# Altium schematic sheet Tien.SchDoc: TKHTN project
size A4; Date: 7/11/2023; ApprovedBy: Nguyen Phu Tien; CheckedBy: Nguyen Phu Tien; Author: Nguyen Phu Tien; CompanyName: Nguyen Phu Tien; DrawnBy: Nguyen Phu Tien; Revision: 1.0; SheetNumber: 1; SheetTotal: 1; Time: 19:45
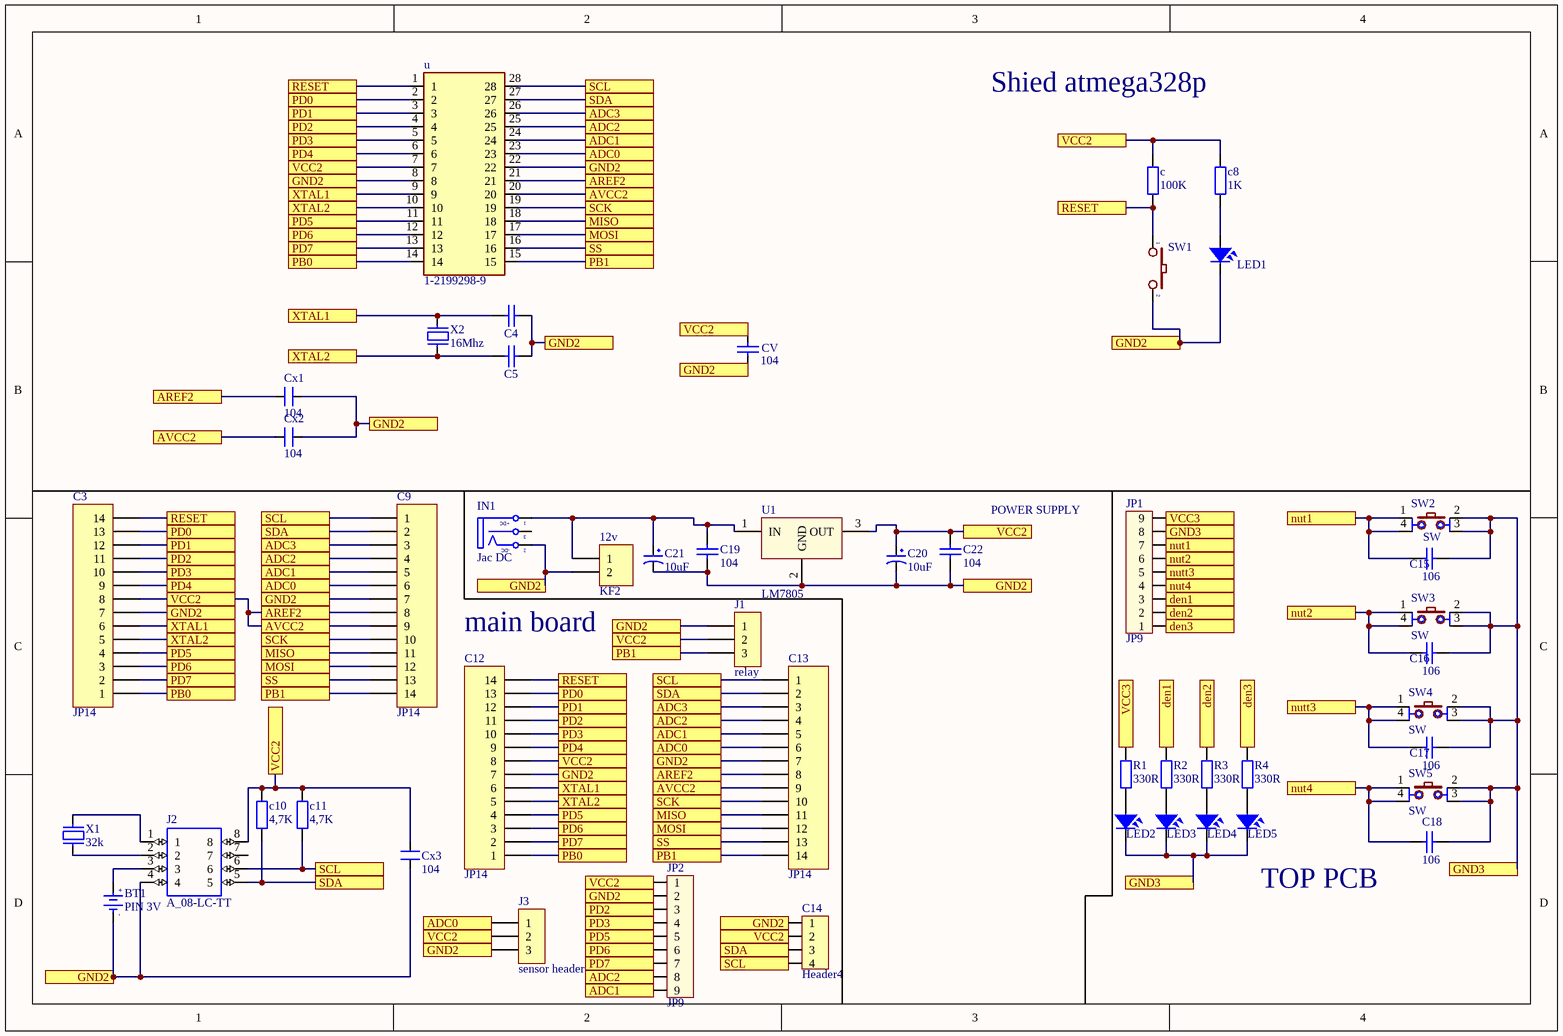
[diagram p0: Tien.SchDoc]

## Parts
12v  KF2  [KF2-5.08]
BT1  PIN 3V  [PIN3V]
c  100K  [tro vach 1/4w]
C3  JP14  [JP14-C1T]
C4  MH  [Tu-pico]  (value not drawn)
C5  MH  [Tu-pico]  (value not drawn)
c8  1K  [tro vach 1/4w]
C9  JP14  [JP14-C1T]
c10  4,7K  [tro vach 1/4w]
c11  4,7K  [tro vach 1/4w]
C12  JP14  [JP14-C1T]
C13  JP14  [JP14-C1T]
C14  Header4  [Header4]
C15  106  [Tu 0805]
C16  106  [Tu 0805]
C17  106  [Tu 0805]
C18  106  [Tu 0805]
C19  104  [tu gom]
C20  10uF  [tu hoa 4mm]
C21  10uF  [tu hoa 4mm]
C22  104  [tu gom]
CV  104  [tu gom]
Cx1  104  [CN1]
Cx2  104  [CN1]
Cx3  104  [CN1]
IN1  Jac DC  [DC0]
J1  relay  [Header_Duc Cong_3P 2.54]
J2  A_08-LC-TT  [DIPS762W61P254L1016H525Q8N]
J3  sensor header  [Header_Duc Cong_3P 2.54]
JP1  JP9  [Header9]
JP2  JP9  [Header9]
LED1  LED  [LED-5-RED]  (value not drawn)
LED2  LED  [LED-0805-Red]  (value not drawn)
LED3  LED  [LED-0805-Red]  (value not drawn)
LED4  LED  [LED-0805-Red]  (value not drawn)
LED5  LED  [LED-0805-Red]  (value not drawn)
R1  330R  [Tro SMD 0805]
R2  330R  [Tro SMD 0805]
R3  330R  [Tro SMD 0805]
R4  330R  [Tro SMD 0805]
SW1  (no value)  [SW2]
SW2  SW  [SW2-SMD]
SW3  SW  [SW2-SMD]
SW4  SW  [SW2-SMD]
SW5  SW  [SW2-SMD]
u  1-2199298-9  [DIP762W60P254L3556H510Q28]
U1  LM7805  [QTO-220H3]
X1  32k  [XT32k]
X2  16Mhz  [XT2]

## Ports
ADC0, ADC1, ADC2, ADC3, AREF2, AVCC2, den1, den2, den3, GND2, GND3, MISO, MOSI, nut1, nut2, nut4, nutt3, PB0, PB1, PD0, PD1, PD2, PD3, PD4, PD5, PD6, PD7, RESET, SCK, SCL, SDA, SS, VCC2, VCC3, XTAL1, XTAL2

## Nets
ADC0: C9.6 C13.6 J3.1 u.23 ; port ADC0
ADC1: C9.5 C13.5 JP2.9 u.24 ; port ADC1
ADC2: C9.4 C13.4 JP2.8 u.25 ; port ADC2
ADC3: C9.3 C13.3 u.26 ; port ADC3
AREF2: c.2 C3.8 c8.2 C9.8 C9.9 c10.2 c11.2 C12.8 C13.8 C13.9 C14.2 C20.1 C22.2 CV.1 Cx1.1 Cx2.1 Cx3.2 J1.2 J2.8 J3.2 JP2.1 u.7 u.20 u.21 U1.3(OUT) ; port VCC2, port AREF2, port AVCC2
den1: JP1.3 R2.2 ; port den1
den2: JP1.2 R3.2 ; port den2
den3: JP1.1 R4.2 ; port den3
GND2: 12v.2 BT1.2(GND) C3.7 C4.2 C5.2 C9.7 C12.7 C13.7 C14.1 C19.2 C20.2 C21.2 C22.1 CV.2 Cx1.2 Cx2.2 Cx3.1 IN1.2(TN) J1.1 J2.4 J3.3 JP2.2 LED1.2 SW1.2 u.8 u.22 U1.2(GND) ; port GND2
GND3: C15.1 C16.1 C17.1 C18.1 JP1.8 LED2.2 LED3.2 LED4.2 LED5.2 SW2.2 SW2.3 SW3.2 SW3.3 SW4.2 SW4.3 SW5.2 SW5.3 ; port GND3
MISO: C9.11 C13.11 u.18 ; port MISO
MOSI: C9.12 C13.12 u.17 ; port MOSI
nut1: C15.2 JP1.7 SW2.1 SW2.4 ; port nut1
nut2: C16.2 JP1.6 SW3.1 SW3.4 ; port nut2
nut4: C18.2 JP1.4 SW5.1 SW5.4 ; port nut4
nutt3: C17.2 JP1.5 SW4.1 SW4.4 ; port nutt3
PB0: C3.1 C12.1 u.14 ; port PB0
PB1: C9.14 C13.14 J1.3 u.15 ; port PB1
PD0: C3.13 C12.13 u.2 ; port PD0
PD1: C3.12 C12.12 u.3 ; port PD1
PD2: C3.11 C12.11 JP2.3 u.4 ; port PD2
PD3: C3.10 C12.10 JP2.4 u.5 ; port PD3
PD4: C3.9 C12.9 u.6 ; port PD4
PD5: C3.4 C12.4 JP2.5 u.11 ; port PD5
PD6: C3.3 C12.3 JP2.6 u.12 ; port PD6
PD7: C3.2 C12.2 JP2.7 u.13 ; port PD7
RESET: c.1 C3.14 C12.14 SW1.1 u.1 ; port RESET
SCK: C9.10 C13.10 u.19 ; port SCK
SCL: C9.1 c11.1 C13.1 C14.4 J2.6 u.28 ; port SCL
SDA: C9.2 c10.1 C13.2 C14.3 J2.5 u.27 ; port SDA
SS: C9.13 C13.13 u.16 ; port SS
VCC3: JP1.9 R1.2 ; port VCC3
XTAL1: C3.6 C4.1 C12.6 u.9 X2.2 ; port XTAL1
XTAL2: C3.5 C5.1 C12.5 u.10 X2.1 ; port XTAL2
Net12v_1: 12v.1 C19.1 C21.1 IN1.1(T) U1.1(IN)
NetBT1_1: BT1.1(+3V) J2.3
Netc8_1: c8.1 LED1.1
NetJ2_1: J2.1 X1.2
NetJ2_2: J2.2 X1.1
NetLED2_1: LED2.1 R1.1
NetLED3_1: LED3.1 R2.1
NetLED4_1: LED4.1 R3.1
NetLED5_1: LED5.1 R4.1

Not connected (* = marked no-connect by the designer): IN1 3(S); J2 7

## Notes on the sheet
- Shied atmega328p
- (near C22) POWER SUPPLY
- main board
- (near LED5) TOP PCB
- (in symbol DCIN) +DC; -DC
- (in symbol PIN 3V) +; -

## Library data of the parts
12v = KF2: Manufacturer: Würth Elektronik eiSos GmbH; partNo: 691103110002; ComponentLink1 Description: Manufacturer; ComponentLink2 Description: Datasheet; NoPins: 2; Created Date: 29 October 2013; ComponentLink1URL: http://www.we-online.com; ComponentLink2URL: http://katalog.we-online.de/em/datasheet/6911031100xx.pdf; Created by: Karrer Zheng
BT1 = PIN 3V: Battery 3VDC; Value: PIN 3V
c c8 c10 c11 = Tro Vach 1/4W 5% 10k: Căm; Chung_Loai: Cắm; Don_Vi: Con; So_Chan: 2; Ten_Linh_Kien: Trở Vạch 1/4w 5% 10K; Ma_Hang: MH007354; Kieu_Chan: *
C3 C9 C12 C13 = JP14: WR-PHD 2.54 mm Angled Socket Header; Manufacturer: W¨¹rth Elektronik eiSos GmbH; partNo: 613014143121; ComponentLink1 Description: Manufacturer; ComponentLink2 Description: Datasheet; NoPins: 14; Created Date: 29 March 2013; ComponentLink1URL: http://www.we-online.com; ComponentLink2URL: http://katalog.we-online.de/em/datasheet/6130xx143121.pdf; Created by: Karrer Zheng
C4 C5 = Tu 33pF: Cắm; Value: 33p
C14 = Header4: Header IDC, 4 x 1 Pin Vertical 2.54mm Pitch (Non-Boxed, Male); Manufacturer: W¨¹rth Elektronik eiSos GmbH; partNo: 613002143121; ComponentLink1 Description: Manufacturer; ComponentLink2 Description: Datasheet; NoPins: 02; Created Date: 29 March 2013; ComponentLink1URL: http://www.we-online.com; ComponentLink2URL: http://katalog.we-online.de/em/datasheet/6130xx143121.pdf; Created by: Karrer Zheng
C15-C18 = Tu 0805 106 16V 10%: Dán; Ten_Linh_Kien: Tụ 0805 106-10uF 10% 16V; So_Chan: 2; Don_Vi: Con; Ma_Hang: MH004553; Chung_Loai: Dán; Kieu_Chan: *
C19 C22 CV = Tu gom 104 50V: Cắm; So_Chan: 2; Ten_Linh_Kien: Tụ gốm 104 100nF 50V; Don_Vi: Con; Ma_Hang: MH004761; Chung_Loai: Cắm; Kieu_Chan: *
C20 C21 = Tu Hoa 10uF 16V 4x7: Cắm; So_Chan: 2; Don_Vi: Con; Ten_Linh_Kien: Tụ Hóa 10uF 16V; Ma_Hang: MH006855; Chung_Loai: Cắm; Kieu_Chan: *
Cx1-Cx3 = CN0: Cremic For Xtal 1pF => 100pF; Value: 33pF
IN1 = DCIN: Jac DC input; Value: Jac DC
J1 J3 = Header 1_2.54_3P: Cắm; Ma_Hang: *; Ghi_Chu: *; Don_Vi: *; Kieu_Chan: *; Chung_Loai: Cắm
J2 = A_08-LC-TT: 8 (2 x 4) Pos DIP, 0.3 (7.62mm) Row Spacing Socket Tin Through Hole; MP: A 08-LC-TT; MF: Assmann WSW Components; Price: None; SnapEDA_Link: https://www.snapeda.com/parts/A%2008-LC-TT/Assmann%20WSW%20Components/view-part/3092960/?ref=snap; Availability: Unavailable; Value: *; Package: None
JP1 JP2 = Header9: Connector 9; Value: Connector 9
LED1 = LED: LED Single colour Green and Red; Value: LED 3 ly Single Colour
LED2-LED5 = LED SMD: Value: LED 3 - 5 ly 2 Colour
R1-R4 = Tro 0805 5% 330R: Dán; Don_Vi: Con; So_Chan: 2; Ten_Linh_Kien: Trở 0805 5% 330R; Ma_Hang: MH005337; Chung_Loai: Dán; Kieu_Chan: *
SW1 = Nut Nhan 2 Chan ( Dip ): Cắm; Ten_Linh_Kien: Nút Nhấn 2 Chân 6x6x5MM DIP; Ma_Hang: MH001959; Don_Vi: Con; Kieu_Chan: *; Ghi_Chu: *; Chung_Loai: Cắm
SW2-SW5 = SW4: Switch button 4 pin; Value: Button chip 4 pin
u = 1-2199298-9: 28P,DIP SKT,300 CL,LDR,PB FREE; Product_Type: Socket; Number_of_Positions: 28; Centerline_Pitch: 2.54 mm[.1 in]; MF: TE Connectivity; EU_RoHS_Compliance: Compliant; Package: PDIP-28 TE Connectivity; Value: *; MP: 1-2199298-9; SnapEDA_Link: https://www.snapeda.com/parts/1-2199298-9/TE%20Connectivity%20AMP%20Connectors/view-part/1265789/?ref=snap; Digi-Key_Part_Number: A120353-ND; ComponentLink1Description: New link; ComponentLink1URL: *
U1 = LM78xx: On ap +, from + 5 to + 24VDC; Value: LM7805
X1 X2 = XT2: Crystal, 32.768 KHz, -40 to 85 degC, 3.2 x 1.5 x 0.9 mm SMD; Value: 4Mhz